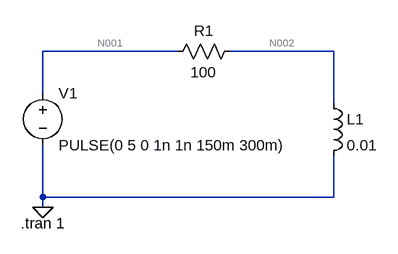
[diagram p0: schematic TP3_ex5.asc]
TP3_ex5.asc, the LTspice schematic file:
Version 4
SHEET 1 1068 680
WIRE 0 -16 -208 -16
WIRE 240 -16 80 -16
WIRE -208 48 -208 -16
WIRE 240 64 240 -16
WIRE -208 208 -208 128
WIRE 240 208 240 144
WIRE 240 208 -208 208
WIRE -208 224 -208 208
FLAG -208 224 0
SYMBOL res 96 -32 R90
WINDOW 0 0 56 VBottom 2
WINDOW 3 32 56 VTop 2
SYMATTR InstName R1
SYMATTR Value 100
SYMBOL ind 224 48 R0
SYMATTR InstName L1
SYMATTR Value 0.01
SYMBOL voltage -208 32 R0
WINDOW 123 0 0 Left 0
WINDOW 39 0 0 Left 0
SYMATTR InstName V1
SYMATTR Value PULSE(0 5 0 1n 1n 150m 300m)
TEXT -242 248 Left 2 !.tran 1

The netlist it stands for:
* TP3_ex5.asc
R1 N002 N001 100
L1 N002 0 0.01
V1 N001 0 PULSE(0 5 0 1n 1n 150m 300m)
.tran 1
.backanno
.end

* Results of the author's LTspice run, read from the files saved beside the schematic
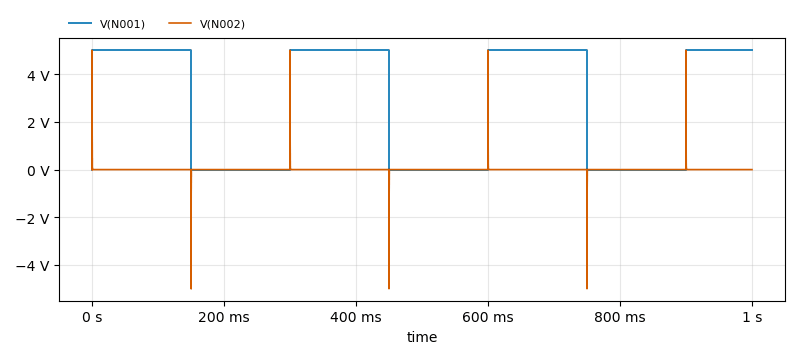
[diagram p1: Transient Analysis of TP3_ex5.asc, plotted from the saved traces]
* Transient Analysis, 1 run:
*   V(N001): min 0 V, max 5 V, average 2.75 V, rms 3.708 V, last 5 V
*   V(N002): min -5 V, max 5 V, average 584.7 µV, rms 96.44 mV, last 50 µV